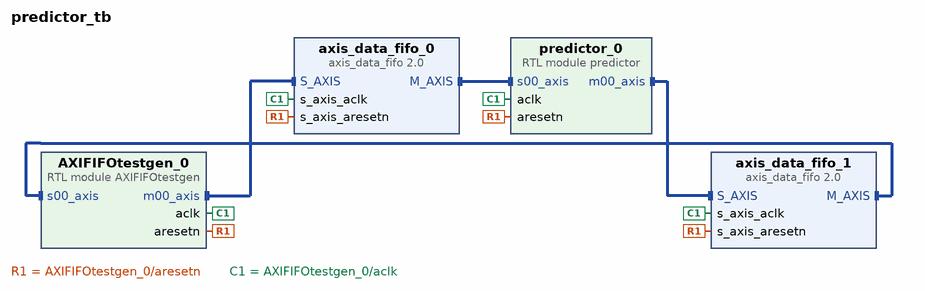
[diagram p0: block diagram of the top level]
# Vivado block design predictor_tb, xc7z020clg400-1, Vivado 2019.2
create_bd_design predictor_tb

create_bd_cell -type module -reference AXIFIFOtestgen AXIFIFOtestgen_0
create_bd_cell -type ip -vlnv xilinx.com:ip:axis_data_fifo:2.0 axis_data_fifo_0
set_property -dict {CONFIG.FIFO_DEPTH 16} [get_bd_cells axis_data_fifo_0]
create_bd_cell -type ip -vlnv xilinx.com:ip:axis_data_fifo:2.0 axis_data_fifo_1
set_property -dict {CONFIG.FIFO_DEPTH 16} [get_bd_cells axis_data_fifo_1]
create_bd_cell -type module -reference predictor predictor_0

# ---- connections ----

connect_bd_intf_net [get_bd_intf_pins axis_data_fifo_0/M_AXIS] [get_bd_intf_pins predictor_0/s00_axis]
connect_bd_intf_net [get_bd_intf_pins AXIFIFOtestgen_0/s00_axis] [get_bd_intf_pins axis_data_fifo_1/M_AXIS]
connect_bd_intf_net [get_bd_intf_pins predictor_0/m00_axis] [get_bd_intf_pins axis_data_fifo_1/S_AXIS]
connect_bd_intf_net [get_bd_intf_pins AXIFIFOtestgen_0/m00_axis] [get_bd_intf_pins axis_data_fifo_0/S_AXIS]
connect_bd_net [get_bd_pins AXIFIFOtestgen_0/aresetn] \
  [get_bd_pins axis_data_fifo_0/s_axis_aresetn] [get_bd_pins axis_data_fifo_1/s_axis_aresetn] \
  [get_bd_pins predictor_0/aresetn]
connect_bd_net [get_bd_pins AXIFIFOtestgen_0/aclk] \
  [get_bd_pins axis_data_fifo_0/s_axis_aclk] [get_bd_pins axis_data_fifo_1/s_axis_aclk] [get_bd_pins predictor_0/aclk]

validate_bd_design
save_bd_design
